# EAGLE schematic ecu (EAGLE 8.5.1)
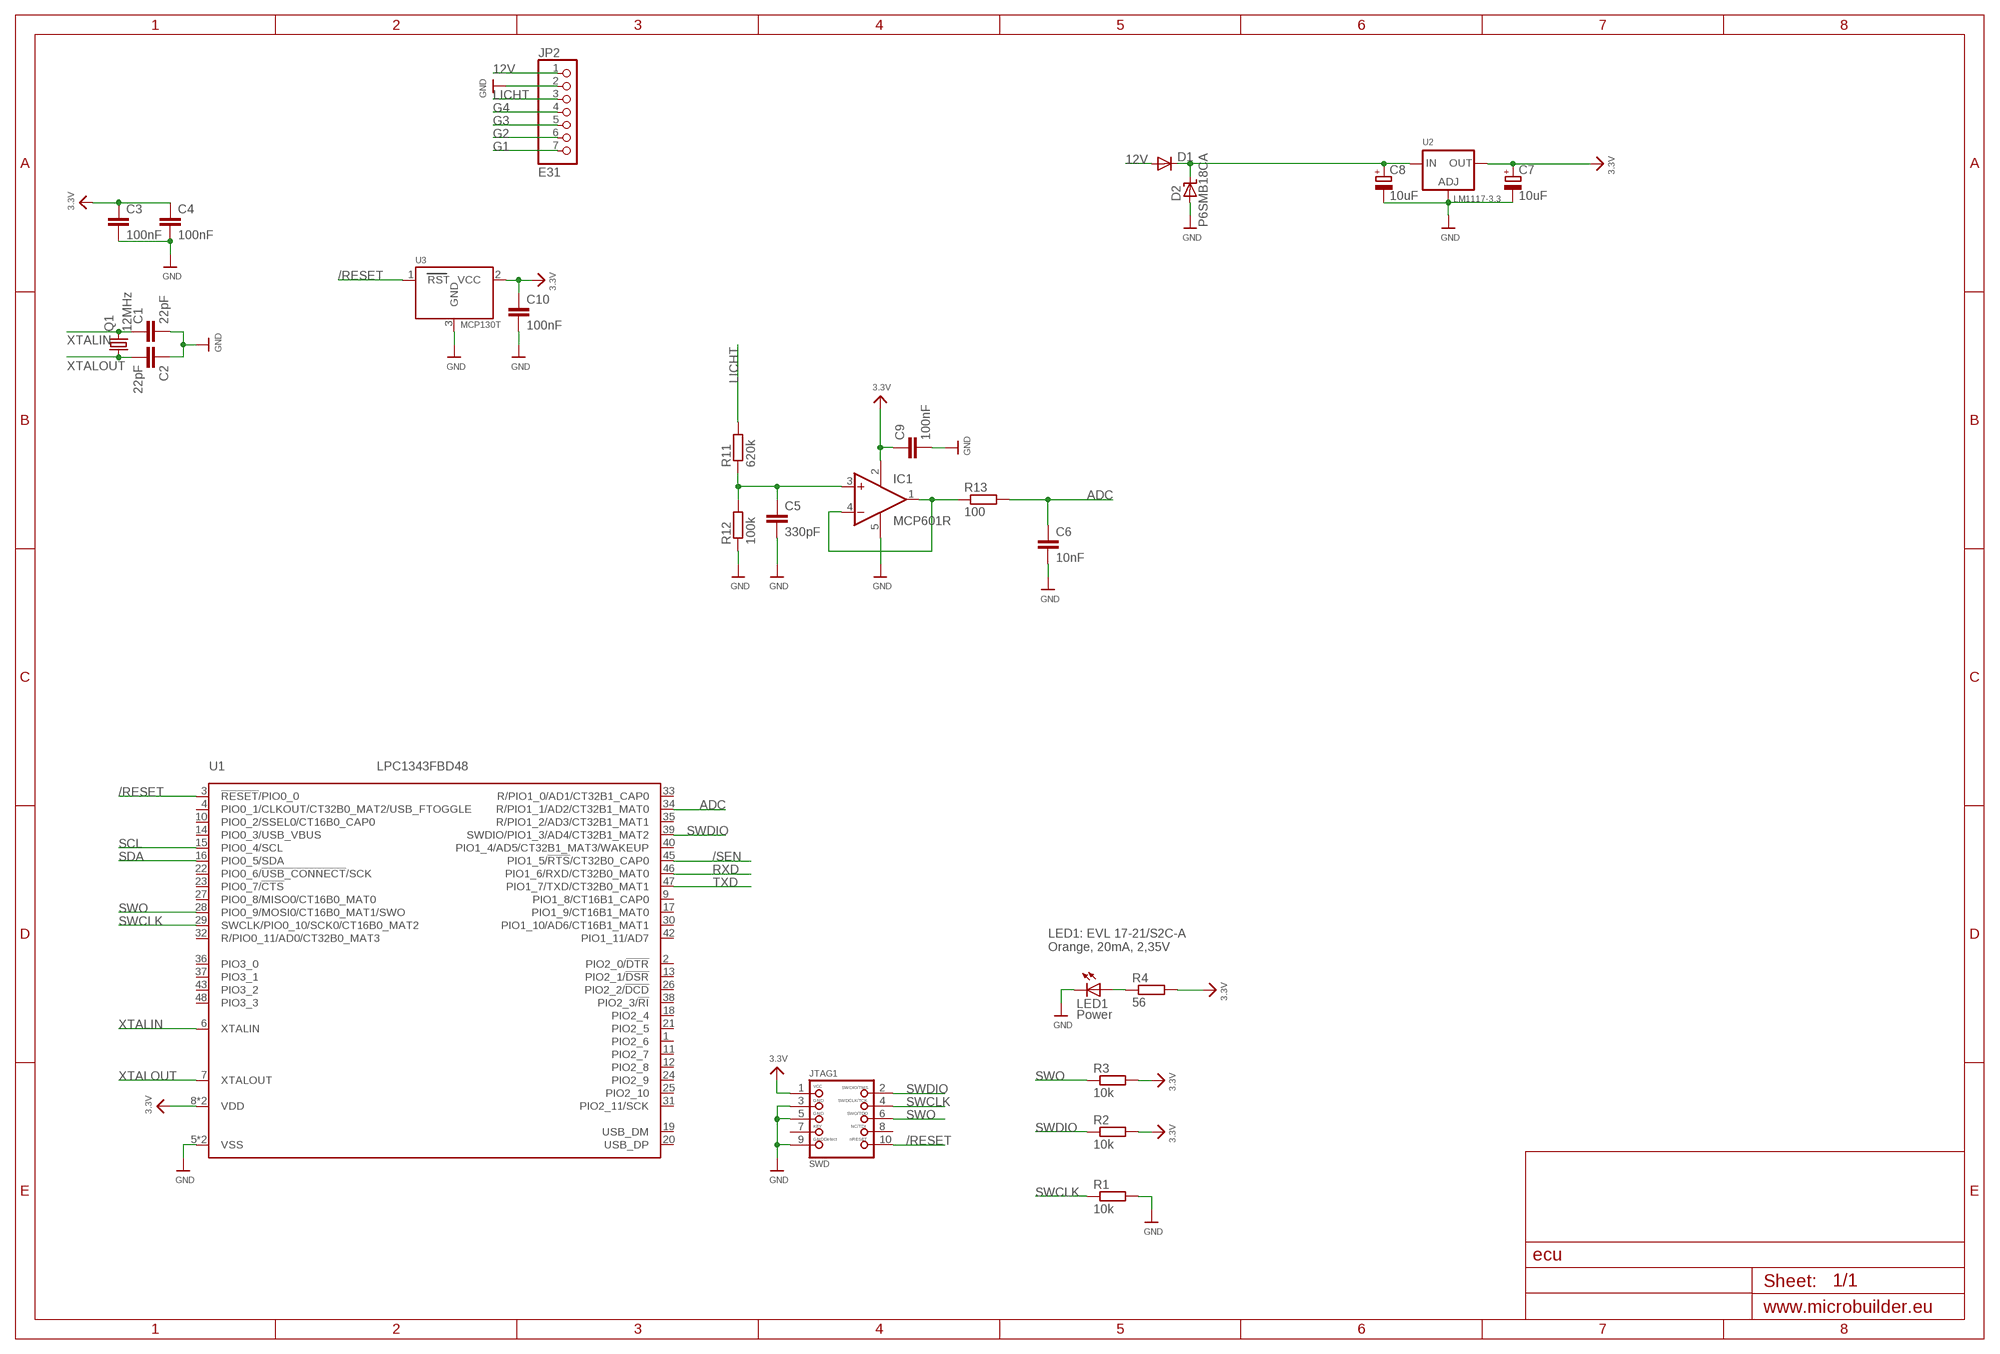
[diagram p0: schematic, sheet 1]

## Parts
C1  22pF  C-EUC0805  [C0805]
C2  22pF  C-EUC0805  [C0805]
C3  100nF  C-EUC0805  [C0805]
C4  100nF  C-EUC0805  [C0805]
C5  330pF  C-EUC0805  [C0805]
C6  10nF  C-EUC0805  [C0805]
C7  10uF  CPOL-EUSMCC  [SMC_C]
C8  10uF  CPOL-EUSMCC  [SMC_C]
C9  100nF  C-EUC0805  [C0805]
C10  100nF  C-EUC0805  [C0805]
D1  DIODE-SMB  [SMB]
D2  P6SMB18CA  SHOTKY-SMDSMB  [DO214AA]
IC1  MCP601R  [SOT23-5]
JP2  E31  HEADER-1X7ROUND  [1X07_ROUND]
JTAG1  SWD  JTAG-CORTEXM3  [2X05_1.27MM_SMT]
LED1  Power  LEDSML0805  [SML0805]
Q1  12MHz  CRYSTALHC49UP  [HC49UP]
R1  10k  R-EU_R0805  [R0805]
R2  10k  R-EU_R0805  [R0805]
R3  10k  R-EU_R0805  [R0805]
R4  56  R-EU_R0805  [R0805]
R11  620k  R-EU_R0805  [R0805]
R12  100k  R-EU_R0805  [R0805]
R13  100  R-EU_R0805  [R0805]
U1  LPC1343FBD48  [SOT313-2]
U2  LM1117-3.3  LM1117SOT223-REFLOW  [SOT223-R]
U3  MCP130T  MCP130TWAVE  [SOT23-W]

## Nets
3.3V: C3.1 C4.1 C7.+ C9.1 C10.1 IC1.2(V+) JTAG1.1 R2.2 R3.2 R4.2 U1.8(VDD) U1.44(VDD) U2.2(OUT) U3.2(VCC)
12V: D1.A JP2.1
/RESET: JTAG1.10 U1.3(!RESET!/PIO0_0) U3.1(RST)
/SEN: U1.45(PIO1_5/!RTS!/CT32B0_CAP0)
ADC: C6.1 R13.2 U1.34(R/PIO1_1/AD2/CT32B1_MAT0)
G1: JP2.7
G2: JP2.6
G3: JP2.5
G4: JP2.4
GND: C1.2 C2.1 C3.2 C4.2 C5.2 C6.2 C7.- C8.- C9.2 C10.2 D2.A IC1.5(V-) JP2.2 JTAG1.3 JTAG1.5 JTAG1.9 LED1.C R1.2 R12.1 U1.5(VSS) U1.41(VSS) U2.1(ADJ) U3.3(GND)
LICHT: JP2.3 R11.2
N$1: C8.+ D1.C D2.C U2.3(IN)
N$2: IC1.1(OUT) IC1.4(-IN) R13.1
N$4: LED1.A R4.1
N$8: C5.1 IC1.3(+IN) R11.1 R12.2
RXD: U1.46(PIO1_6/RXD/CT32B0_MAT0)
SCL: U1.15(PIO0_4/SCL)
SDA: U1.16(PIO0_5/SDA)
SWCLK: JTAG1.4 R1.1 U1.29(SWCLK/PIO0_10/SCK0/CT16B0_MAT2)
SWDIO: JTAG1.2 R2.1 U1.39(SWDIO/PIO1_3/AD4/CT32B1_MAT2)
SWO: JTAG1.6 R3.1 U1.28(PIO0_9/MOSI0/CT16B0_MAT1/SWO)
TXD: U1.47(PIO1_7/TXD/CT32B0_MAT1)
XTALIN: C1.1 Q1.2 U1.6(XTALIN)
XTALOUT: C2.2 Q1.1 U1.7(XTALOUT)
Unconnected: JTAG1.7 JTAG1.8 U1.1(PIO2_6) U1.2(PIO2_0/!DTR!) U1.4(PIO0_1/CLKOUT/CT32B0_MAT2/USB_FTOGGLE) U1.9(PIO1_8/CT16B1_CAP0) U1.10(PIO0_2/SSEL0/CT16B0_CAP0) U1.11(PIO2_7) U1.12(PIO2_8) U1.13(PIO2_1/!DSR!) U1.14(PIO0_3/USB_VBUS) U1.17(PIO1_9/CT16B1_MAT0) U1.18(PIO2_4) U1.19(USB_DM) U1.20(USB_DP) U1.21(PIO2_5) U1.22(PIO0_6/!USB_CONNECT!/SCK) U1.23(PIO0_7/!CTS!) U1.24(PIO2_9) U1.25(PIO2_10) U1.26(PIO2_2/!DCD!) U1.27(PIO0_8/MISO0/CT16B0_MAT0) U1.30(PIO1_10/AD6/CT16B1_MAT1) U1.31(PIO2_11/SCK) U1.32(R/PIO0_11/AD0/CT32B0_MAT3) U1.33(R/PIO1_0/AD1/CT32B1_CAP0) U1.35(R/PIO1_2/AD3/CT32B1_MAT1) U1.36(PIO3_0) U1.37(PIO3_1) U1.38(PIO2_3/!RI!) U1.40(PIO1_4/AD5/CT32B1_MAT3/WAKEUP) U1.42(PIO1_11/AD7) U1.43(PIO3_2) U1.48(PIO3_3)

## Notes on the sheet
- LED1: EVL 17-21/S2C-A
  Orange, 20mA, 2,35V

## Library data of the parts
C1-C6 = rcl:C-EU: CAPACITOR, European symbol
C7 C8 = rcl:CPOL-EU: POLARIZED CAPACITOR, European symbol
C9 C10 = rcl:C-EU: CAPACITOR, European symbol; SPICEPREFIX: C
D1 = diode:DIODE-: DIODE
D2 = Heinrich:SHOTKY-SMD
IC1 = linear:MCP601: Single Op Amp 2.7V to 6.0V Single Supply CMOS Source: http://ww1.microchip.com/downloads/en/DeviceDoc/21314g.pdf
JP2 = microbuilder:HEADER-1X7: PIN HEADER
JTAG1 = microbuilder:JTAG-CORTEXM3: Serial Wire (SW-DP) Connector This standard 0.05" 10-pin connector is for use with the Cortex M0/M3's native SWD (serial wire debugger) interface (SW-DP). Some boards support a 20-pin combined JTAG+SWD connector (SWJ-DP), such as the LPC1700 family, but many smaller devices only work with SWD which typically use the smaller 10-pin SW-DP connecter (the LPC1300 family, for example, only supports SWD). 2x05 1.27mm/0.05" Connector: This is the standard SMT connector defined by ARM for all Cortex devices, and should be used in most situations and for forward-compatibility since any new devices coming to market will likely use this connector. MOLEX 10 Pin 0.1" Connector: This 0.1" 10 pin connector has the same pin layout as the standard 0.05" connector, but is easier to work with if you are using standard jumper wires or custom cables to connect your SWD hardware. MOLEX 20 Pin 0.1" Connector: This 0.1" 20 pin connector is the same model used for ARM7/ARM9 JTAG debuggers, but is connected to match the pins on the Segger J-Link for ARM (which supports both JTAG and SWD debugging). See the following document from ARM for more information on Cortex M3 Debug Connectors: http://infocenter.arm.com/help/topic/com.arm.doc.faqs/attached/13634/cortex_debug_connectors.pdf And the following page for an overview with images of the different connector types: http://www.keil.com/peripherals/coresight/connectors.asp
LED1 = led:LED: LED OSRAM: - CHIPLED LG R971, LG N971, LY N971, LG Q971, LY Q971, LO R971, LY R971 LH N974, LH R974 LS Q976, LO Q976, LY Q976 LO Q996 - Hyper CHIPLED LW Q18S LB Q993, LB Q99A, LB R99A - SideLED LS A670, LO A670, LY A670, LG A670, LP A670 LB A673, LV A673, LT A673, LW A673 LH A674 LY A675 LS A676, LA A676, LO A676, LY A676, LW A676 LS A679, LY A679, LG A679 - Hyper Micro SIDELED® LS Y876, LA Y876, LO Y876, LY Y876 LT Y87S - SmartLED LW L88C, LW L88S LB L89C, LB L89S, LG L890 LS L89K, LO L89K, LY L89K LS L896, LA L896, LO L896, LY L896 - TOPLED LS T670, LO T670, LY T670, LG T670, LP T670 LSG T670, LSP T670, LSY T670, LOP T670, LYG T670 LG T671, LOG T671, LSG T671 LB T673, LV T673, LT T673, LW T673 LH T674 LS T676, LA T676, LO T676, LY T676, LB T676, LH T676, LSB T676, LW T676 LB T67C, LV T67C, LT T67C, LS T67K, LO T67K, LY T67K, LW E67C LS E67B, LA E67B, LO E67B, LY E67B, LB E67C, LV E67C, LT E67C LW T67C LS T679, LY T679, LG T679 LS T770, LO T770, LY T770, LG T770, LP T770 LB T773, LV T773, LT T773, LW T773 LH T774 LS E675, LA E675, LY E675, LS T675 LS T776, LA T776, LO T776, LY T776, LB T776 LHGB T686 LT T68C, LB T68C - Hyper Mini TOPLED® LB M676 - Mini TOPLED Santana® LG M470 LS M47K, LO M47K, LY M47K Source: http://www.osram.convergy.de LUXEON: - LUMILED® LXK2-PW12-R00, LXK2-PW12-S00, LXK2-PW14-U00, LXK2-PW14-V00 LXK2-PM12-R00, LXK2-PM12-S00, LXK2-PM14-U00 LXK2-PE12-Q00, LXK2-PE12-R00, LXK2-PE12-S00, LXK2-PE14-T00, LXK2-PE14-U00 LXK2-PB12-K00, LXK2-PB12-L00, LXK2-PB12-M00, LXK2-PB14-N00, LXK2-PB14-P00, LXK2-PB14-Q00 LXK2-PR12-L00, LXK2-PR12-M00, LXK2-PR14-Q00, LXK2-PR14-R00 LXK2-PD12-Q00, LXK2-PD12-R00, LXK2-PD12-S00 LXK2-PH12-R00, LXK2-PH12-S00 LXK2-PL12-P00, LXK2-PL12-Q00, LXK2-PL12-R00 Source: www.luxeon.com KINGBRIGHT: KA-3528ASYC Source: www.kingbright.com
Q1 = crystal:CRYSTAL: CRYSTAL; OC_FARNELL: unknown; OC_NEWARK: unknown
R1-R4 = rcl:R-EU_: RESISTOR, European symbol; SPICEPREFIX: R
R11-R13 = rcl:R-EU_: RESISTOR, European symbol
U1 = nxp_60_1_1:LPC1343FBD48: 32-bit ARM Cortex-M3 microcontroller; up to 32 kB flash and 8 kB SRAM; USB device The LPC1311/13/42/43 are ARM Cortex-M3 based microcontrollers for embedded applications featuring a high level of integration and low power consumption. The ARM Cortex-M3 is a next generation core that offers system enhancements such as enhanced debug features and a higher level of support block integration. The LPC1311/13/42/43 operate at CPU frequencies of up to 72 MHz. The ARM Cortex-M3 CPU incorporates a 3-stage pipeline and uses a Harvard architecture with separate local instruction and data buses as well as a third bus for peripherals. The ARM Cortex-M3 CPU also includes an internal prefetch unit that supports speculative branching. The peripheral complement of the LPC1311/13/42/43 includes up to 32 kB of flash memory, up to 8 kB of data memory, USB Device (LPC1342/43 only), one Fast-mode Plus I 2 C-bus interface, one UART, four general purpose timers, and up to 42 general purpose I/O pins. Remark: The LPC1311/13/42/43 series consists of the LPC1300 series (parts LPC1311/13/42/43) and the LPC1300L series (parts LPC1311/01 and LPC1313/01). The LPC1300L series features the following enhancements over the LPC1300 series: Power profiles with lower power consumption in Active and Sleep modes. Four levels for BOD forced reset. Second SSP controller (LPC1313FBD48/01 only). Windowed Watchdog Timer (WWDT). Internal pull-up resistors pull up pins to full VDD level. Programmable pseudo open-drain mode for GPIO pins. AAL Eindhoven MK; ADC: 8; FLASH: 32kB; PWR_PROFILES: no; SERIES: LPC1300; SRAM: 8kB; SSP: 1; USB: Device
U2 = microbuilder:LM1117: LM1117 Voltage Regulator LM1117 Adjustable Voltage regulator [Digikey: LM1117IMP-ADJDKR-ND] LM1117 3.3V Voltage regulator [AP1117E33GDIDKR-ND] LM1117 5.0V Voltage regulator [AP1117E50GDIDKR-ND] SOT223-REFLOW - SOT223 package for solder paste/reflow ovens SOT223-WAVE - SOT223 package for hand-soldering (larger pads) Note: For the fixed-voltage regulators, simply set the ADJ pin to GND.
U3 = microbuilder:MCP130T: MCP130T Voltage Supervisor (Active Low) Voltage supervisors will put the MCU in a reset state if the voltage drops below a pre-determined level. SOT23-R/SOT23-W: Voltage Supervisor - 3.15V Active Low Note: Use the "Reflow" footprint when working with solder paste, and the "Wave" footprint when soldering by hand with a soldering iron (the latter has larger pads that are easier to solder by hand). Digikey: MCP130T-315I/TTCT-ND